# EAGLE design esp (EAGLE 6.5.0)
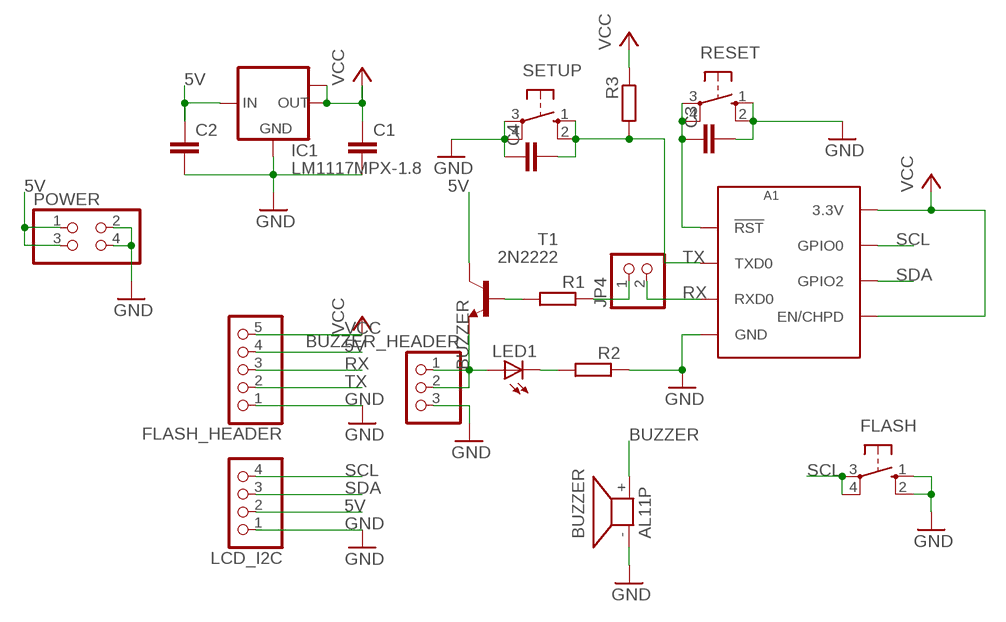
[diagram p0: schematic, sheet 1]

## Parts
A1  ESP8266_ESP-01  [ESP8266_ESP-01_NO-SILKSCREEN]
BUZZER  AL11P  [AL11P]
BUZZER_HEADER  PINHD-1X3  [1X03]
C1  C-EU050-025X075  [C050-025X075]
C2  C-EU050-025X075  [C050-025X075]
C3  C-EU050-025X075  [C050-025X075]
C4  C-EU050-025X075  [C050-025X075]
FLASH  10-XX  [B3F-10XX]
FLASH_HEADER  PINHD-1X5  [1X05]
IC1  LM1117MPX-1.8  [SOT223]
JP4  PINHD-1X2  [1X02]
LCD_I2C  PINHD-1X4  [1X04]
LED1  LED5MM  [LED5MM]
POWER  PINHD-2X2  [2X02]
R1  R-EU_0207/10  [0207/10]
R2  R-EU_0207/10  [0207/10]
R3  R-EU_0207/10  [0207/10]
RESET  10-XX  [B3F-10XX]
SETUP  10-XX  [B3F-10XX]
T1  2N2222  [TO18]

## Nets
5V: C2.1 FLASH_HEADER.4 IC1.3(IN) LCD_I2C.2 POWER.1 POWER.3 T1.3(C)
BUZZER: BUZZER.+ BUZZER_HEADER.1 BUZZER_HEADER.2 LED1.A T1.1(E)
GND: A1.GND BUZZER.- BUZZER_HEADER.3 C1.2 C2.2 C3.2 C4.1 FLASH.1(S) FLASH.2(S1) FLASH_HEADER.1 IC1.1(GND) LCD_I2C.1 POWER.2 POWER.4 R2.1 RESET.1(S) RESET.2(S1) SETUP.3(P) SETUP.4(P1)
N$1: JP4.1 R1.1
N$2: R1.2 T1.2(B)
N$4: A1.RST(!RST!) C3.1 RESET.3(P) RESET.4(P1)
N$6: LED1.K(C) R2.2
RX: A1.RX(RXD0) FLASH_HEADER.3 JP4.2
SCL: A1.GPIO0 FLASH.3(P) FLASH.4(P1) LCD_I2C.4
SDA: A1.GPIO2 LCD_I2C.3
TX: A1.TX(TXD0) C4.2 FLASH_HEADER.2 R3.2 SETUP.1(S) SETUP.2(S1)
VCC: A1.3V3(3.3V) A1.EN/CH_PD(EN/CHPD) C1.1 FLASH_HEADER.5 IC1.2(OUT) IC1.TAB(OUT1) R3.1

## Library data of the parts
A1 = LuisLab-Boards:ESP8266_ESP-?
BUZZER = buzzer:AL11P: SPEAKER Source: Buerklin; OC_FARNELL: unknown; OC_NEWARK: unknown
BUZZER_HEADER = pinhead:PINHD-1X3: PIN HEADER
C1-C4 = resistor:C-EU: CAPACITOR, European symbol
FLASH RESET SETUP = switch-omron:10-XX: OMRON SWITCH; MPN: B3F-1000; OC_FARNELL: 176432; OC_NEWARK: 36M3542
FLASH_HEADER = pinhead:PINHD-1X5: PIN HEADER
IC1 = lm1117:LM1117MPX-*
JP4 = pinhead:PINHD-1X2: PIN HEADER
LCD_I2C = pinhead:PINHD-1X4: PIN HEADER
LED1 = led:LED: LED OSRAM: - CHIPLED LG R971, LG N971, LY N971, LG Q971, LY Q971, LO R971, LY R971 LH N974, LH R974 LS Q976, LO Q976, LY Q976 LO Q996 - Hyper CHIPLED LW Q18S LB Q993, LB Q99A, LB R99A - SideLED LS A670, LO A670, LY A670, LG A670, LP A670 LB A673, LV A673, LT A673, LW A673 LH A674 LY A675 LS A676, LA A676, LO A676, LY A676, LW A676 LS A679, LY A679, LG A679 - Hyper Micro SIDELED® LS Y876, LA Y876, LO Y876, LY Y876 LT Y87S - SmartLED LW L88C, LW L88S LB L89C, LB L89S, LG L890 LS L89K, LO L89K, LY L89K LS L896, LA L896, LO L896, LY L896 - TOPLED LS T670, LO T670, LY T670, LG T670, LP T670 LSG T670, LSP T670, LSY T670, LOP T670, LYG T670 LG T671, LOG T671, LSG T671 LB T673, LV T673, LT T673, LW T673 LH T674 LS T676, LA T676, LO T676, LY T676, LB T676, LH T676, LSB T676, LW T676 LB T67C, LV T67C, LT T67C, LS T67K, LO T67K, LY T67K, LW E67C LS E67B, LA E67B, LO E67B, LY E67B, LB E67C, LV E67C, LT E67C LW T67C LS T679, LY T679, LG T679 LS T770, LO T770, LY T770, LG T770, LP T770 LB T773, LV T773, LT T773, LW T773 LH T774 LS E675, LA E675, LY E675, LS T675 LS T776, LA T776, LO T776, LY T776, LB T776 LHGB T686 LT T68C, LB T68C - Hyper Mini TOPLED® LB M676 - Mini TOPLED Santana® LG M470 LS M47K, LO M47K, LY M47K Source: http://www.osram.convergy.de LUXEON: - LUMILED® LXK2-PW12-R00, LXK2-PW12-S00, LXK2-PW14-U00, LXK2-PW14-V00 LXK2-PM12-R00, LXK2-PM12-S00, LXK2-PM14-U00 LXK2-PE12-Q00, LXK2-PE12-R00, LXK2-PE12-S00, LXK2-PE14-T00, LXK2-PE14-U00 LXK2-PB12-K00, LXK2-PB12-L00, LXK2-PB12-M00, LXK2-PB14-N00, LXK2-PB14-P00, LXK2-PB14-Q00 LXK2-PR12-L00, LXK2-PR12-M00, LXK2-PR14-Q00, LXK2-PR14-R00 LXK2-PD12-Q00, LXK2-PD12-R00, LXK2-PD12-S00 LXK2-PH12-R00, LXK2-PH12-S00 LXK2-PL12-P00, LXK2-PL12-Q00, LXK2-PL12-R00 Source: www.luxeon.com KINGBRIGHT: KA-3528ASYC Source: www.kingbright.com
POWER = pinhead:PINHD-2X2: PIN HEADER
R1-R3 = resistor:R-EU_: RESISTOR, European symbol
T1 = transistor-neu-to92:2N2222: NPN TRANSISTOR

## Board
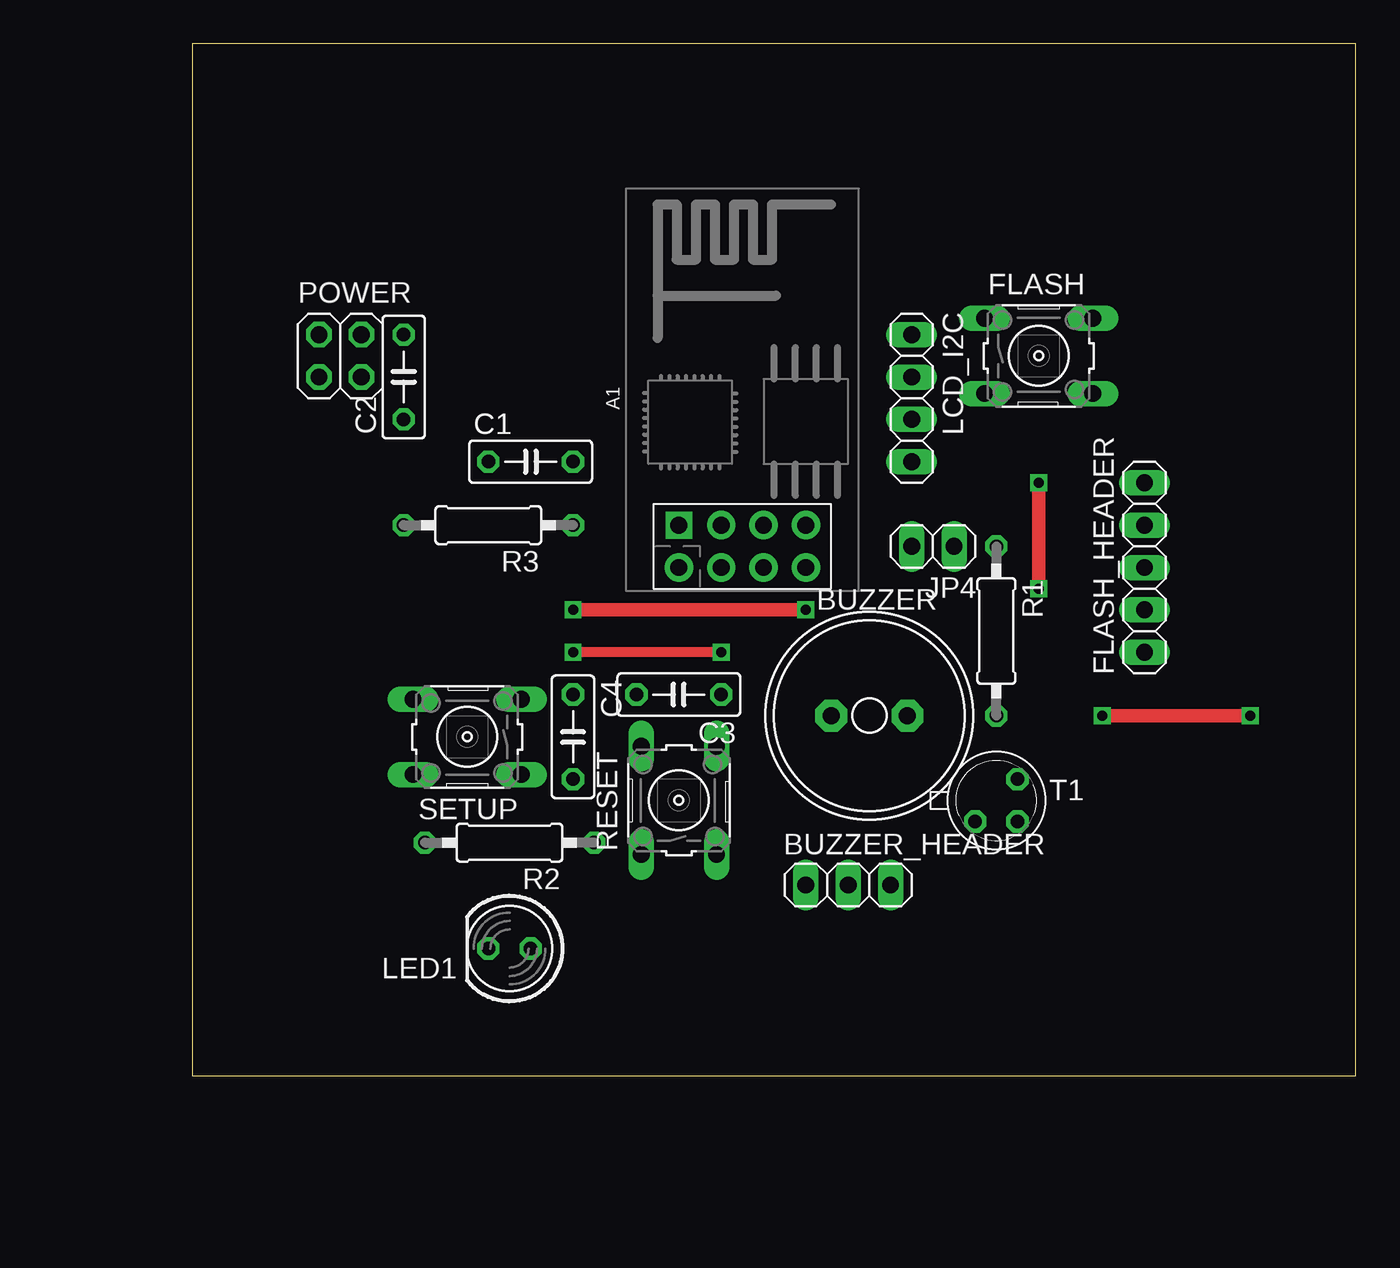
[diagram p1: board, top side]
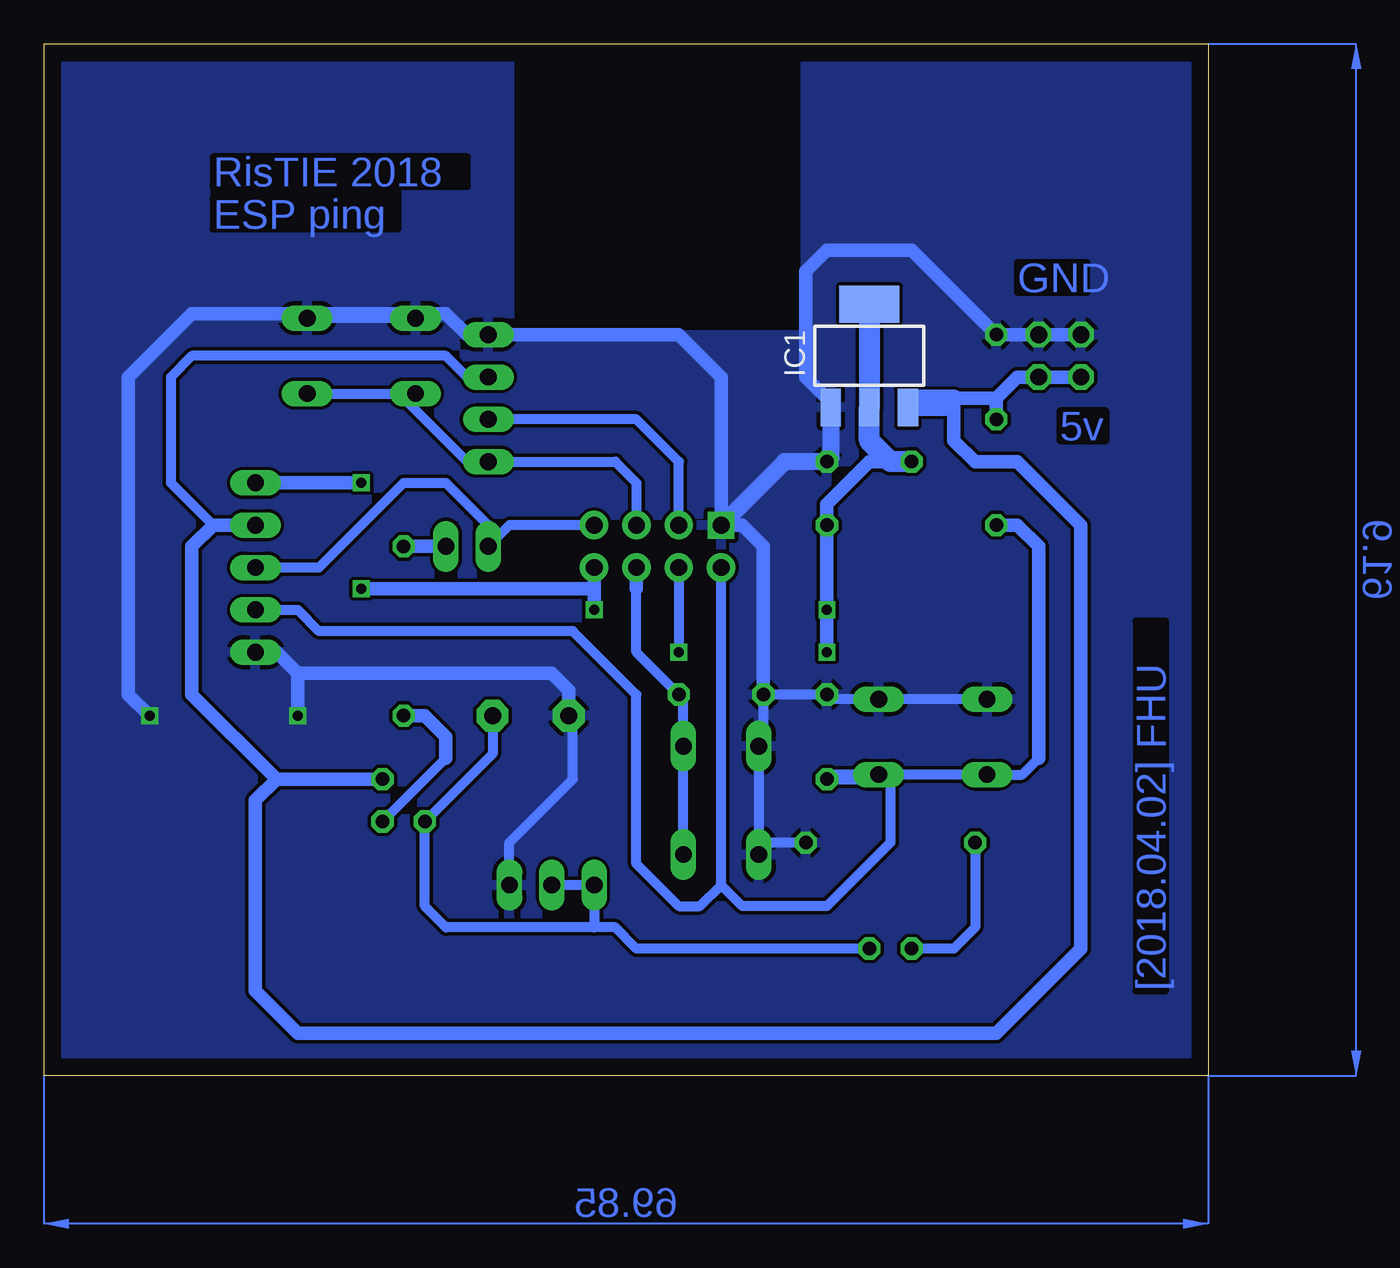
[diagram p2: board, bottom side, seen from below]

Size 69.83 x 61.9 mm. Coordinates in mm from the lower left corner, seen from the top.
Outline: 0,0 69.83,0 69.83,61.9 0,61.9 0,0
Copper layers (1*16): Top 0.035mm / dielectric 1.5mm / Bottom 0.035mm
Design rules "default": minimum track width 10mil, minimum drill 24mil, track to track 8mil, track to pad 8mil, pad to pad 8mil, via to via 8mil, smd to smd 8mil, copper to edge 40mil, drill to drill 8mil, minimum pad ring 10mil, minimum via ring 8mil, stop-mask expansion 4mil, vias tented up to drill 0mil, thermal gap 10mil

### Footprints (pad centres in the part's own frame; a part is rotated, then mirrored left to right if it is on the bottom)
ESP8266_ESP-01_NO-SILKSCREEN = drill 1.016 pad 1.7: 3V3 -1.27,-3.81; EN/CH_PD -1.27,1.27; GPIO0 1.27,-1.27; GPIO2 1.27,1.27; RST -1.27,-1.27; RX 1.27,-3.81; TX -1.27,3.81 | drill 1.016 pad 1.6 square: GND 1.27,3.81
AL11P = drill 1.016 pad 1.905 octagon: + 2.286,0; - -2.286,0
1X03 = drill 1.016 long: 1 -2.54,0; 2 0,0; 3 2.54,0
C050-025X075 = drill 0.813 octagon: 1 -2.54,0; 2 2.54,0
B3F-10XX = drill 1.016 long: 1 -3.251,2.261; 2 3.251,2.261; 3 -3.251,-2.261; 4 3.251,-2.261
1X05 = drill 1.016 long: 1 -5.08,0; 2 -2.54,0; 3 0,0; 4 2.54,0; 5 5.08,0
SOT223 = smd 1.219 x 2.235: 1 -2.311,-3.099; 2 0,-3.099; 3 2.311,-3.099 | smd 3.6 x 2.2: TAB 0,3.099
1X02 = drill 1.016 long: 1 -1.27,0; 2 1.27,0
1X04 = drill 1.016 long: 1 -3.81,0; 2 -1.27,0; 3 1.27,0; 4 3.81,0
LED5MM = drill 0.813 octagon: A -1.27,0; K 1.27,0
2X02 = drill 1.016 octagon: 1 -1.27,-1.27; 2 -1.27,1.27; 3 1.27,-1.27; 4 1.27,1.27
0207/10 = drill 0.813 octagon: 1 -5.08,0; 2 5.08,0
TO18 = drill 0.813 octagon: 1 -1.27,-1.27; 2 1.27,-1.27; 3 1.27,1.27

### Placement (x,y rotation side)
A1  33.02,31.75 90 top
BUZZER  40.64,21.59 0 top
BUZZER_HEADER  39.37,11.43 0 top
C1  20.32,36.83 0 top
C2  12.7,41.91 90 top
C3  29.21,22.86 180 top
C4  22.86,20.32 270 top
FLASH  50.8,43.18 0 top
FLASH_HEADER  57.15,30.48 90 top
IC1  20.32,43.18 0 bottom
JP4  44.45,31.75 180 top
LCD_I2C  43.18,40.64 270 top
LED1  19.05,7.62 180 top
POWER  8.89,43.18 0 top
R1  48.26,26.67 270 top
R2  19.05,13.97 180 top
R3  17.78,33.02 180 top
RESET  29.21,16.51 90 top
SETUP  16.51,20.32 180 top
T1  48.26,16.51 0 top

### Tracks (layer width: path | path; a pad name or v marks a point on that pad's centre or on a via)
5V
  Bottom 0.61: LCD_I2C.2 44.45,41.91 45.72,43.18 60.96,43.18 62.23,41.91 62.23,35.56 59.69,33.02
  Bottom 0.813: T1.3 55.88,17.78 | 55.88,17.78 57.15,16.51 57.15,5.08 54.61,2.54 12.7,2.54 7.62,7.62 7.62,33.02 11.43,36.83 13.97,36.83 15.24,38.1 15.24,40.64 12.7,40.64 | FLASH_HEADER.4 59.69,33.02 60.96,31.75 60.96,22.86 55.88,17.78 | POWER.1 POWER.3 11.43,41.91 12.7,40.64 | C2.1 12.7,40.64
  Bottom 1.016: 15.24,40.64 17.45,40.64 IC1.3 15.8,40.08 15.24,40.64
BUZZER
  Bottom 0.61: 36.83,8.89 35.56,8.89 34.29,7.62 LED1.A | 36.83,8.89 45.72,8.89 46.99,10.16 T1.1 42.93,19.3 BUZZER.+ | 36.83,8.89 BUZZER_HEADER.1 BUZZER_HEADER.2
GND  (via drill 0.6)
  Top 0.813: v63.5,21.59 v54.61,21.59
  Bottom 0.61: LCD_I2C.1 44.45,44.45 | 45.72,45.72 47.27,45.72 FLASH.1 FLASH.2 | SETUP.4 SETUP.3 22.58,22.58 C4.1 C3.2 26.67,20.04 RESET.2 26.95,14.25 26.45,13.75 | R2.1 26.24,13.97 26.45,13.75 | 26.45,13.75 RESET.1 | BUZZER_HEADER.3 41.91,13.97 38.1,17.78 38.1,21.34 BUZZER.-
  Bottom 0.813: LCD_I2C.1 31.75,44.45 29.21,41.91 A1.GND 27.94,33.02 26.67,31.75 C3.2 | 44.45,44.45 45.72,45.72 60.96,45.72 64.77,41.91 64.77,22.86 v63.5,21.59 | FLASH_HEADER.1 55.88,25.4 54.61,24.13 | 54.61,24.13 v54.61,21.59 | POWER.2 POWER.4 C2.2 17.78,49.53 22.86,49.53 24.13,48.26 24.13,41.91 22.86,40.64 | BUZZER.- 38.35,23.11 39.37,24.13 54.61,24.13
  Bottom 1.016: IC1.1 22.63,37.06 C1.2 25.4,36.83 A1.GND
  pour Bottom: 0,60.96 0,0 69.85,0 69.85,60.96 41.91,60.96 41.91,44.45 24.13,44.45 24.13,60.96
N$1
  Bottom 0.813: JP4.1 R1.1
N$2
  Bottom 0.61: T1.2 45.72,19.05
  Bottom 0.813: R1.2 46.99,21.59 45.72,20.32 45.72,19.05
N$4
  Bottom 0.61: RESET.3 RESET.4 31.47,22.58 C3.1 34.29,25.4 A1.RST
  Bottom 0.813: 34.29,29.21 A1.RST
N$6
  Bottom 0.61: R2.2 13.97,8.89 15.24,7.62 LED1.K
RX
  Bottom 0.61: FLASH_HEADER.3 53.34,30.48 48.26,35.56 45.72,35.56 43.18,33.02 JP4.2 41.91,33.02 A1.RX
SCL
  Bottom 0.61: A1.GPIO0 34.29,35.56 35.56,36.83 LCD_I2C.4 44.45,36.83 48.26,40.64 | 48.26,40.64 47.83,40.64 FLASH.3 | FLASH.4 48.54,40.92 48.26,40.64
SDA
  Bottom 0.61: A1.GPIO2 31.75,36.83 34.29,39.37 LCD_I2C.3
TX
  Bottom 0.61: FLASH_HEADER.2 54.61,27.94 53.34,26.67 38.1,26.67 34.29,22.86 34.29,12.7 31.75,10.16 30.48,10.16 29.21,11.43 | 10.16,19.05 11.15,18.06 SETUP.2 SETUP.1 22.58,18.06 C4.2 19.05,17.78 19.05,13.97 22.86,10.16 27.94,10.16 29.21,11.43 | 29.21,11.43 A1.TX
  Bottom 0.813: R3.2 11.43,33.02 10.16,31.75 10.16,19.05
VCC  (via drill 0.6)
  Top 0.61: v31.75,25.4 v22.86,25.4
  Top 0.813: v36.83,27.94 v22.86,27.94 | v50.8,29.21 v50.8,35.56
  Bottom 0.61: A1.EN/CH_PD v31.75,25.4
  Bottom 0.813: C1.1 20.32,36.83 22.86,34.29 R3.1 v22.86,27.94 v22.86,25.4 | 36.83,29.21 v36.83,27.94 | A1.3V3 36.83,29.21 | 36.83,29.21 v50.8,29.21 | v50.8,35.56 FLASH_HEADER.5
  Bottom 1.27: IC1.TAB IC1.2 20.32,38.1 19.05,36.83 C1.1
(copper drawn outside any net)
  shapes: Bottom area x2

### Text on the board
Bottom: RisTIE 2018 | ESP ping | GND | 5v | [2018.04.02] FHU